# EasyEDA schematic easyeda.json
TITLE: Streetlight; REV: 1.0; Date: 2019-09-27; Sheet: 1/1; Drawn By: Simen Stensås; Company: NTNU
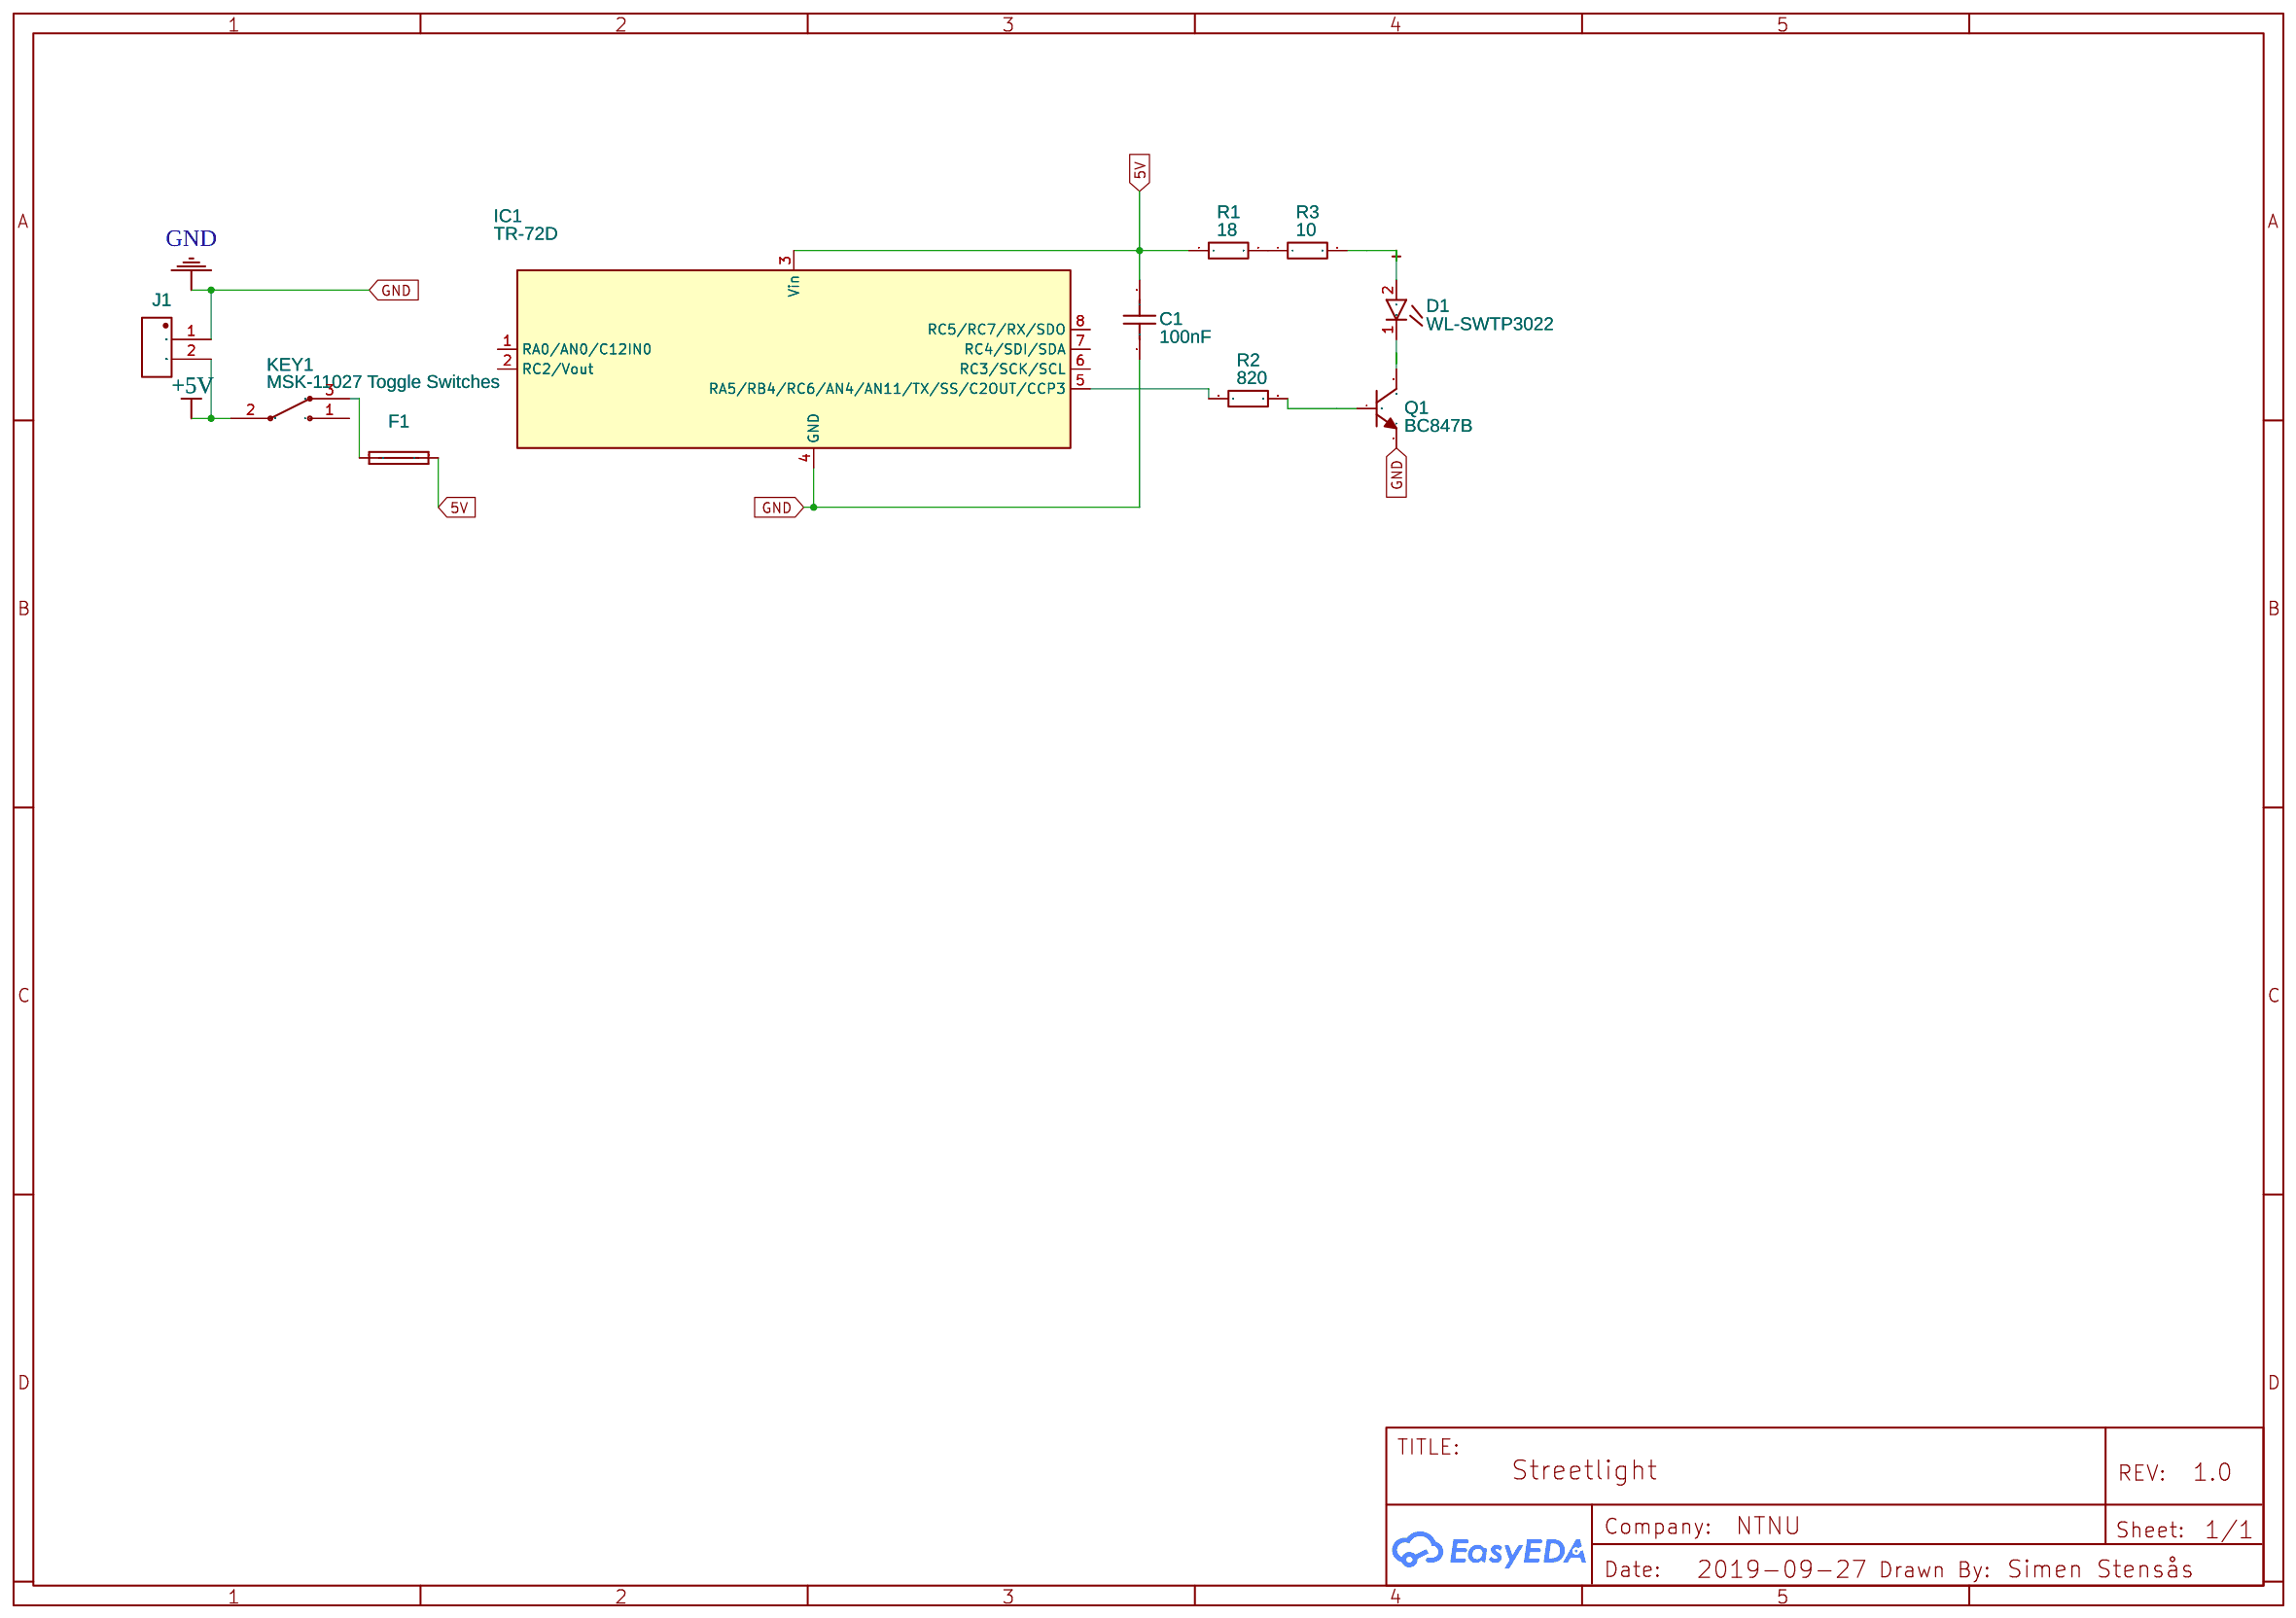
[diagram p0: schematic sheet]

## Parts
C1  100nF  [1210]
D1  WL-SWTP3022  [WL-SWTP_3022]
F1  NO  [OMF_125]
IC1  TR-72D  [IQRF_KON-SIM-01]
J1  KF127_2P_5.08  [KF127_2P_5.08]
KEY1  MSK-11027 Toggle Switches  [MSK-11027]
Q1  BC847B  [SOT-23(SOT-23-3)]
R1  18  [1206]
R2  820  [1206]
R3  10  [1206]

## Library data of the parts
C1 = 1210B106K100CT: Supplier: LCSC; Supplier Part: C304011; Manufacturer: Huaxin S&T; Contributor: LCSC
D1 = -: WL-SWTP; forwardVoltage: 3.2V
F1 = -: Manufacturer Part: 3403.0015.11; Supplier: Mouser; Supplier Part: 693-3403.0015.11; link: https://www.mouser.co.uk/ProductDetail/Schurter/3403001511?qs=sGAEpiMZZMtxU2g%2f1juGqdRmCQF0%252bT4VUkZkHB0fJk4%3d; Contributor: romiksm
IC1 = -: Contributor: Simen Stensas; license: https://www.gnu.org/licenses/lgpl-2.1.html
J1 = -: Manufacturer: Kefa Electronics; Manufacturer Part: KF127L-5.08; Contributor: GrahamG
KEY1 = -: Supplier Part: C21381; Supplier: LCSC; Manufacturer: ReliaPro; image: http://image.lceda.cn/szlcsc/C21381.jpg
Q1 = -: Supplier: LCSC; Manufacturer: Hottech; Contributor: LCSC; Supplier Part: C181140
R1 = CR1206-FX-18R0ELF: Supplier: LCSC; Supplier Part: C204720; Manufacturer: BOURNS; Contributor: LCSC
R2 = AECR1206F820RK9: Supplier: LCSC; Supplier Part: C352031; Manufacturer: ResistorToday; Contributor: LCSC
R3 = AECR1206F10R0K9: Supplier: LCSC; Supplier Part: C352161; Manufacturer: ResistorToday; Contributor: LCSC

## Nets
5V: C1.2 F1.2 IC1.3(Vin) R1.1
+5V: J1.2(PIN2) KEY1.2
GND: C1.1 IC1.4(GND) J1.1(PIN1) Q1.2(E)
Net-(D1-1): D1.1 Q1.3(C)
Net-(D1-2): D1.2 R3.2
Net-(F1-1): F1.1 KEY1.3
Net-(IC1-5): IC1.5(RA5/RB4/RC6/AN4/AN11/TX/SS/C2OUT/CCP3) R2.1
Net-(Q1-1): Q1.1(B) R2.2
Net-(R1-2): R1.2 R3.1

Not connected (* = marked no-connect by the designer): IC1 1(RA0/AN0/C12IN0) 2(RC2/Vout) 6(RC3/SCK/SCL) 7(RC4/SDI/SDA) 8(RC5/RC7/RX/SDO); KEY1 1
